# Altium schematic sheet Humpback.schdoc: Humpback
size 420 x 297 mm; EDA_Number: ARTIQ; Projet: Humpback; Author: G.Kasprowicz; CompanyName: WUT ISE; DrawnBy: G.Kasprowicz; Organization: WUT ISE; Address1: PW ISE; Address2: Nowowiejska 15/19 00-665 Warsaw; Address3: gkasprow@gmail.com; DocumentNumber: 1; Revision: 1.0; SheetNumber: 1; SheetTotal: 11; ModifiedBy: -; CheckedDate: -; Title2: Top v1.0; DivGrp: WUT ISE; Designer: G.Kasprowicz; ModifiedDate: -; ProjectName: Sensor Box
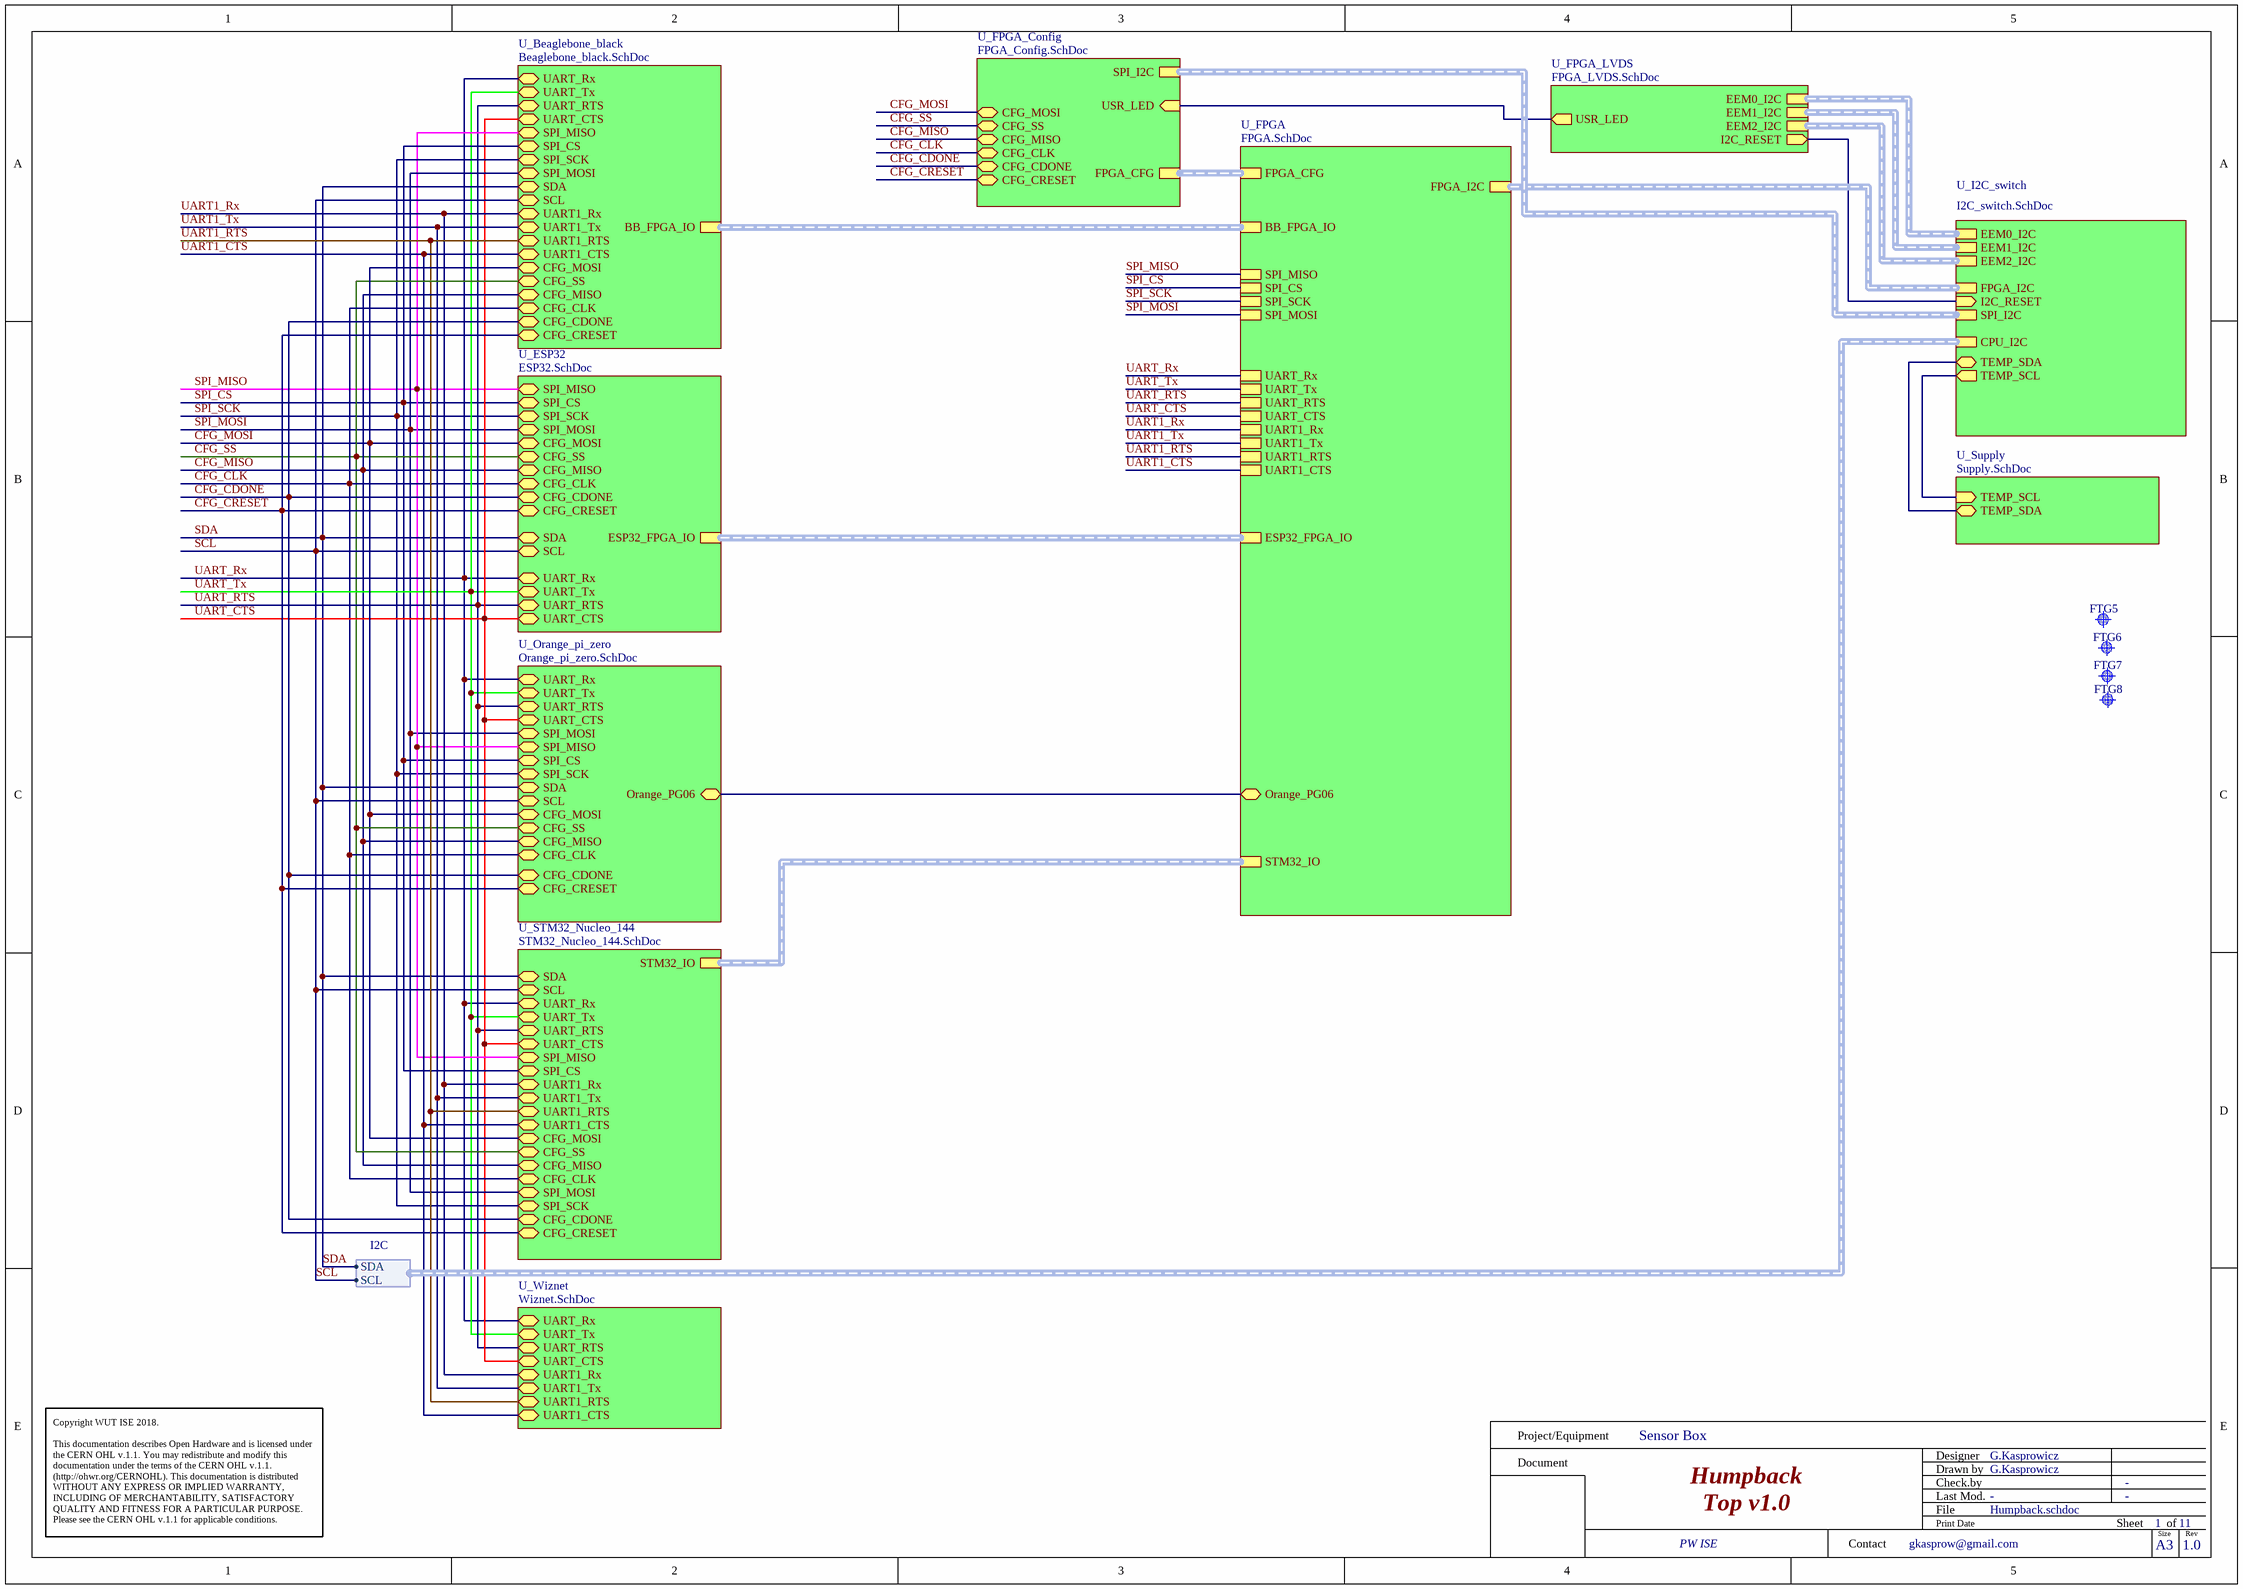
[diagram p0: Humpback.schdoc]

## Parts
FTG5  Use only in PCB  [FIDUCIAL_TOP_C100-200]  (value not drawn)
FTG6  Use only in PCB  [FIDUCIAL_TOP_S100-200]  (value not drawn)
FTG7  Use only in PCB  [FIDUCIAL_TOP_S200-400]  (value not drawn)
FTG8  Use only in PCB  [FIDUCIAL_TOP_S100-200]  (value not drawn)

## Sub-sheets
U_Beaglebone_black = Beaglebone_black.SchDoc: UART_Rx (bidir), UART_Tx (bidir), UART_RTS (bidir), UART_CTS (bidir), SPI_MISO (bidir), SPI_CS (bidir), SPI_SCK (bidir), SCL (bidir), SDA (bidir), SPI_MOSI (bidir), UART1_Rx (bidir), UART1_Tx (bidir), UART1_RTS (bidir), UART1_CTS (bidir), CFG_MOSI (bidir), CFG_SS (bidir), CFG_MISO (bidir), CFG_CLK (bidir), CFG_CDONE (bidir), CFG_CRESET (bidir), BB_FPGA_IO (harness BB_FPGA_IO)
U_ESP32 = ESP32.SchDoc: SPI_MISO (bidir), SPI_CS (bidir), SPI_SCK (bidir), SPI_MOSI (bidir), CFG_MOSI (bidir), CFG_SS (bidir), CFG_MISO (bidir), CFG_CLK (bidir), UART_RTS (bidir), UART_Rx (bidir), UART_Tx (bidir), SDA (bidir), SCL (bidir), UART_CTS (bidir), CFG_CDONE (bidir), CFG_CRESET (bidir), ESP32_FPGA_IO (harness ESP32_FPGA_IO)
U_FPGA = FPGA.SchDoc: FPGA_I2C (harness I2C), FPGA_CFG (harness FPGA_CFG), BB_FPGA_IO (harness BB_FPGA_IO), SPI_MISO, SPI_CS, SPI_SCK, SPI_MOSI, UART_Rx, UART_Tx, UART_RTS, UART_CTS, UART1_Rx, UART1_Tx, UART1_RTS, UART1_CTS, ESP32_FPGA_IO (harness ESP32_FPGA_IO), Orange_PG06 (bidir), STM32_IO (harness STM32_IO)
U_FPGA_Config = FPGA_Config.SchDoc: FPGA_CFG (harness FPGA_CFG), SPI_I2C (harness I2C), USR_LED (in), CFG_CLK (bidir), CFG_MISO (bidir), CFG_SS (bidir), CFG_MOSI (bidir), CFG_CDONE (bidir), CFG_CRESET (bidir)
U_FPGA_LVDS = FPGA_LVDS.SchDoc: EEM0_I2C (harness I2C), EEM1_I2C (harness I2C), EEM2_I2C (harness I2C), USR_LED (out), I2C_RESET (out)
U_I2C_switch = I2C_switch.SchDoc: EEM0_I2C (harness I2C), EEM1_I2C (harness I2C), FPGA_I2C (harness I2C), SPI_I2C (harness I2C), I2C_RESET (in), TEMP_SCL (out), TEMP_SDA (bidir), EEM2_I2C (harness I2C), CPU_I2C (harness I2C)
U_Orange_pi_zero = Orange_pi_zero.SchDoc: UART_Rx (bidir), UART_Tx (bidir), UART_RTS (bidir), UART_CTS (bidir), SPI_MOSI (bidir), SPI_MISO (bidir), SPI_CS (bidir), SPI_SCK (bidir), SDA (bidir), SCL (bidir), CFG_MOSI (bidir), CFG_SS (bidir), CFG_MISO (bidir), CFG_CLK (bidir), CFG_CDONE (bidir), CFG_CRESET (bidir), Orange_PG06 (bidir)
U_STM32_Nucleo_144 = STM32_Nucleo_144.SchDoc: STM32_IO (harness STM32_IO), SDA (bidir), SCL (bidir), UART_Rx (bidir), UART_Tx (bidir), UART_RTS (bidir), UART_CTS (bidir), SPI_MISO (bidir), SPI_CS (bidir), UART1_Rx (bidir), UART1_Tx (bidir), UART1_RTS (bidir), UART1_CTS (bidir), CFG_MOSI (bidir), CFG_SS (bidir), CFG_MISO (bidir), CFG_CLK (bidir), SPI_MOSI (bidir), SPI_SCK (bidir), CFG_CDONE (bidir), CFG_CRESET (bidir)
U_Supply = Supply.SchDoc: TEMP_SCL (in), TEMP_SDA (bidir)
U_Wiznet = Wiznet.SchDoc: UART_Rx (bidir), UART_Tx (bidir), UART_RTS (bidir), UART_CTS (bidir), UART1_Rx (bidir), UART1_Tx (bidir), UART1_RTS (bidir), UART1_CTS (bidir)

## Harnesses
I2C: SDA, SCL

## Nets
CFG_CDONE: sheet U_FPGA_Config/CFG_CDONE, sheet U_ESP32/CFG_CDONE, sheet U_Orange_pi_zero/CFG_CDONE, sheet U_STM32_Nucleo_144/CFG_CDONE, sheet U_Beaglebone_black/CFG_CDONE
CFG_CLK: sheet U_FPGA_Config/CFG_CLK, sheet U_ESP32/CFG_CLK, sheet U_Orange_pi_zero/CFG_CLK, sheet U_STM32_Nucleo_144/CFG_CLK, sheet U_Beaglebone_black/CFG_CLK
CFG_CRESET: sheet U_FPGA_Config/CFG_CRESET, sheet U_ESP32/CFG_CRESET, sheet U_Orange_pi_zero/CFG_CRESET, sheet U_STM32_Nucleo_144/CFG_CRESET, sheet U_Beaglebone_black/CFG_CRESET
CFG_MISO: sheet U_FPGA_Config/CFG_MISO, sheet U_ESP32/CFG_MISO, sheet U_Orange_pi_zero/CFG_MISO, sheet U_STM32_Nucleo_144/CFG_MISO, sheet U_Beaglebone_black/CFG_MISO
CFG_MOSI: sheet U_FPGA_Config/CFG_MOSI, sheet U_ESP32/CFG_MOSI, sheet U_Orange_pi_zero/CFG_MOSI, sheet U_STM32_Nucleo_144/CFG_MOSI, sheet U_Beaglebone_black/CFG_MOSI
CFG_SS: sheet U_FPGA_Config/CFG_SS, sheet U_ESP32/CFG_SS, sheet U_Orange_pi_zero/CFG_SS, sheet U_STM32_Nucleo_144/CFG_SS, sheet U_Beaglebone_black/CFG_SS
SCL: sheet U_ESP32/SCL, sheet U_Orange_pi_zero/SCL, sheet U_STM32_Nucleo_144/SCL, sheet U_Beaglebone_black/SCL, sheet U_I2C_switch/CPU_I2C.SCL
SDA: sheet U_ESP32/SDA, sheet U_Orange_pi_zero/SDA, sheet U_STM32_Nucleo_144/SDA, sheet U_Beaglebone_black/SDA, sheet U_I2C_switch/CPU_I2C.SDA
SPI_CS: sheet U_FPGA/SPI_CS, sheet U_ESP32/SPI_CS, sheet U_Orange_pi_zero/SPI_CS, sheet U_STM32_Nucleo_144/SPI_CS, sheet U_Beaglebone_black/SPI_CS
SPI_MISO: sheet U_FPGA/SPI_MISO, sheet U_ESP32/SPI_MISO, sheet U_Orange_pi_zero/SPI_MISO, sheet U_STM32_Nucleo_144/SPI_MISO, sheet U_Beaglebone_black/SPI_MISO
SPI_MOSI: sheet U_FPGA/SPI_MOSI, sheet U_ESP32/SPI_MOSI, sheet U_Orange_pi_zero/SPI_MOSI, sheet U_STM32_Nucleo_144/SPI_MOSI, sheet U_Beaglebone_black/SPI_MOSI
SPI_SCK: sheet U_FPGA/SPI_SCK, sheet U_ESP32/SPI_SCK, sheet U_Orange_pi_zero/SPI_SCK, sheet U_STM32_Nucleo_144/SPI_SCK, sheet U_Beaglebone_black/SPI_SCK
UART1_CTS: sheet U_FPGA/UART1_CTS, sheet U_STM32_Nucleo_144/UART1_CTS, sheet U_Wiznet/UART1_CTS, sheet U_Beaglebone_black/UART1_CTS
UART1_RTS: sheet U_FPGA/UART1_RTS, sheet U_STM32_Nucleo_144/UART1_RTS, sheet U_Wiznet/UART1_RTS, sheet U_Beaglebone_black/UART1_RTS
UART1_Rx: sheet U_FPGA/UART1_Rx, sheet U_STM32_Nucleo_144/UART1_Rx, sheet U_Wiznet/UART1_Rx, sheet U_Beaglebone_black/UART1_Rx
UART1_Tx: sheet U_FPGA/UART1_Tx, sheet U_STM32_Nucleo_144/UART1_Tx, sheet U_Wiznet/UART1_Tx, sheet U_Beaglebone_black/UART1_Tx
UART_CTS: sheet U_FPGA/UART_CTS, sheet U_ESP32/UART_CTS, sheet U_Orange_pi_zero/UART_CTS, sheet U_STM32_Nucleo_144/UART_CTS, sheet U_Wiznet/UART_CTS, sheet U_Beaglebone_black/UART_CTS
UART_RTS: sheet U_FPGA/UART_RTS, sheet U_ESP32/UART_RTS, sheet U_Orange_pi_zero/UART_RTS, sheet U_STM32_Nucleo_144/UART_RTS, sheet U_Wiznet/UART_RTS, sheet U_Beaglebone_black/UART_RTS
UART_Rx: sheet U_FPGA/UART_Rx, sheet U_ESP32/UART_Rx, sheet U_Orange_pi_zero/UART_Rx, sheet U_STM32_Nucleo_144/UART_Rx, sheet U_Wiznet/UART_Rx, sheet U_Beaglebone_black/UART_Rx
UART_Tx: sheet U_FPGA/UART_Tx, sheet U_ESP32/UART_Tx, sheet U_Orange_pi_zero/UART_Tx, sheet U_STM32_Nucleo_144/UART_Tx, sheet U_Wiznet/UART_Tx, sheet U_Beaglebone_black/UART_Tx
(unnamed): sheet U_FPGA_LVDS/USR_LED, sheet U_FPGA_Config/USR_LED
(unnamed): sheet U_FPGA_LVDS/I2C_RESET, sheet U_I2C_switch/I2C_RESET
(unnamed): sheet U_FPGA/Orange_PG06, sheet U_Orange_pi_zero/Orange_PG06
(unnamed): sheet U_I2C_switch/TEMP_SCL, sheet U_Supply/TEMP_SCL
(unnamed): sheet U_I2C_switch/TEMP_SDA, sheet U_Supply/TEMP_SDA

## Buses and harness runs
harness sheet U_Beaglebone_black/BB_FPGA_IO = sheet U_FPGA/BB_FPGA_IO
harness sheet U_ESP32/ESP32_FPGA_IO = sheet U_FPGA/ESP32_FPGA_IO
harness sheet U_FPGA/FPGA_CFG = sheet U_FPGA_Config/FPGA_CFG
harness sheet U_FPGA/FPGA_I2C = sheet U_I2C_switch/FPGA_I2C
harness sheet U_FPGA/STM32_IO = sheet U_STM32_Nucleo_144/STM32_IO
harness sheet U_FPGA_Config/SPI_I2C = sheet U_I2C_switch/SPI_I2C
harness sheet U_FPGA_LVDS/EEM0_I2C = sheet U_I2C_switch/EEM0_I2C
harness sheet U_FPGA_LVDS/EEM1_I2C = sheet U_I2C_switch/EEM1_I2C
harness sheet U_FPGA_LVDS/EEM2_I2C = sheet U_I2C_switch/EEM2_I2C

## Notes on the sheet
- Project/Equipment
- Document
- Designer
- Drawn by
- Check.by
- Copyright WUT ISE 2018.
  This documentation describes Open Hardware and is licensed under the CERN OHL v.1.1. You may redistribute and modify this documentation under the terms of the CERN OHL v.1.1. (http://ohwr.org/CERNOHL). This documentation is distributed WITHOUT ANY EXPRESS OR IMPLIED WARRANTY, INCLUDING OF MERCHANTABILITY, SATISFACTORY QUALITY AND FITNESS FOR A PARTICULAR PURPOSE. Please see the CERN OHL v.1.1 for applicable conditions.
- Contact
- File
- Last Mod.
- Print Date
- Sheet
- Size
- A3
- of
- Rev

## Library data of the parts
FTG5 = FIDUCIAL_TARGET_C100-200: Fiducial Target; Part Description: Round Fiducial Target, Top Layer, 1.0mm, Top Solder 2.0mm, Keepout =2.0mm; Mounted: No; Part Number: FIDUCIAL_TARGET_C100-200; Component Kind: Standard (No BOM); Component Type: Standard (No BOM); Pin Count: 1; Family: Fiducial; Socket: No; SMD: Yes; Sense: No; Status: None; ComponentHeight: 0mm; HelpURL: Undefined; Author: CERN DEM JLC; CreateDate: 09.02.2010; LatestRevisionDate: 04.04.2012; PackageDescription: Round Fiducial Target, Top Layer, 1.0mm, Top Solder 2.0mm, Keepout =2.0mm
FTG6 FTG8 = FIDUCIAL_TARGET_S100-200: Fiducial Target; Part Description: Square Fiducial Target, Top Layer, 1.0mm, Top Solder 2.0mm, Keepout =2.0mm; Mounted: No; Part Number: FIDUCIAL_TARGET_S100-200; Component Kind: Standard (No BOM); Component Type: Standard (No BOM); Pin Count: 1; Family: Fiducial; Socket: No; SMD: Yes; Sense: No; Status: None; ComponentHeight: 0mm; HelpURL: Undefined; Author: CERN DEM JLC; CreateDate: 09.02.2010; LatestRevisionDate: 04.04.2012; PackageDescription: Square Fiducial Target, Top Layer, 1.0mm, Top Solder 2.0mm, Keepout =2.0mm
FTG7 = FIDUCIAL_TARGET_S200-400: Fiducial Target; Part Description: Square Fiducial Target, Top Layer, 2.0mm, Top Solder 4.0mm, Keepout =4.0mm; Mounted: No; Part Number: FIDUCIAL_TARGET_S200-400; Component Kind: Standard (No BOM); Component Type: Standard (No BOM); Pin Count: 1; Family: Fiducial; Socket: No; SMD: Yes; Sense: No; Status: None; ComponentHeight: 0mm; HelpURL: Undefined; Author: CERN DEM JLC; CreateDate: 02.06.2008; LatestRevisionDate: 04.04.2012; PackageDescription: Square Fiducial Target, Top Layer, 2.0mm, Top Solder 4.0mm, Keepout =4.0mm